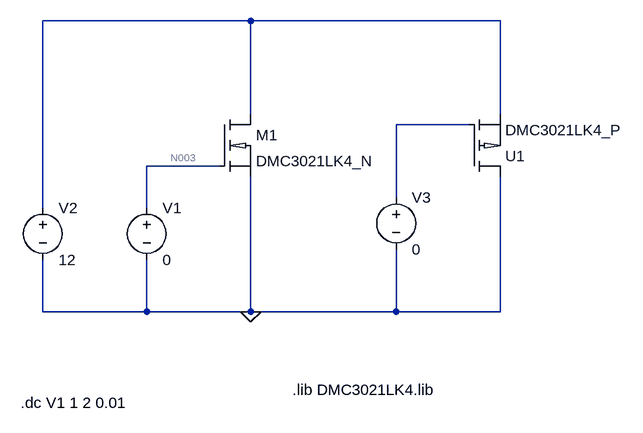
[diagram p0: schematic LT_CALIF_FET.asc]
LT_CALIF_FET.asc, the LTspice schematic file:
Version 4
SHEET 1 2404 1432
WIRE 1248 -400 928 -400
WIRE 1632 -400 1248 -400
WIRE 1248 -256 1248 -400
WIRE 1632 -256 1632 -400
WIRE 1584 -240 1472 -240
WIRE 1200 -176 1088 -176
WIRE 1472 -128 1472 -240
WIRE 928 -112 928 -400
WIRE 1088 -112 1088 -176
WIRE 928 48 928 -32
WIRE 1088 48 1088 -32
WIRE 1088 48 928 48
WIRE 1248 48 1248 -160
WIRE 1248 48 1088 48
WIRE 1472 48 1472 -48
WIRE 1472 48 1248 48
WIRE 1632 48 1632 -160
WIRE 1632 48 1472 48
FLAG 1248 48 0
SYMBOL nmos_3021 1200 -256 R0
SYMATTR InstName M1
SYMBOL voltage 1088 -128 R0
SYMATTR InstName V1
SYMATTR Value 0
SYMBOL voltage 928 -128 R0
WINDOW 123 0 0 Left 0
WINDOW 39 0 0 Left 0
SYMATTR InstName V2
SYMATTR Value 12
SYMBOL voltage 1472 -144 R0
WINDOW 123 0 0 Left 0
WINDOW 39 0 0 Left 0
SYMATTR InstName V3
SYMATTR Value 0
SYMBOL Custom\\pmos_3021 1584 -160 M180
SYMATTR InstName U1
TEXT 1312 168 Left 2 !.lib DMC3021LK4.lib
TEXT 894 188 Left 2 !.dc V1 1 2 0.01

The netlist it stands for:
* LT_CALIF_FET.asc
XM1 N001 N003 0 DMC3021LK4_N  ; pins D G S
V1 N003 0 0
V2 N001 0 12
V3 N002 0 0
XU1 0 N002 N001 DMC3021LK4_P  ; pins D G S
.lib DMC3021LK4.lib
.dc V1 1 2 0.01
.lib DMC3021LK4.lib
.backanno
.end

* Results of the author's LTspice run, read from the files saved beside the schematic
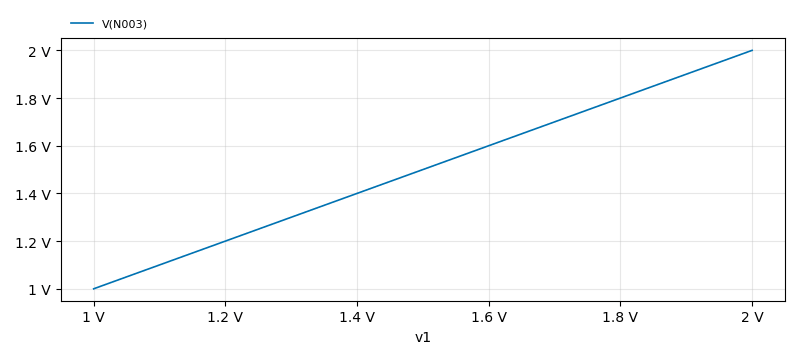
[diagram p1: DC transfer characteristic of LT_CALIF_FET.asc, plotted from the saved traces]
* DC transfer characteristic, 1 run:
*   V(N003): 1 V at v1=1 V, 2 V at v1=2 V, min 1 V, max 2 V